# Altium project LTC2208_High-Z_probe.PrjPcb
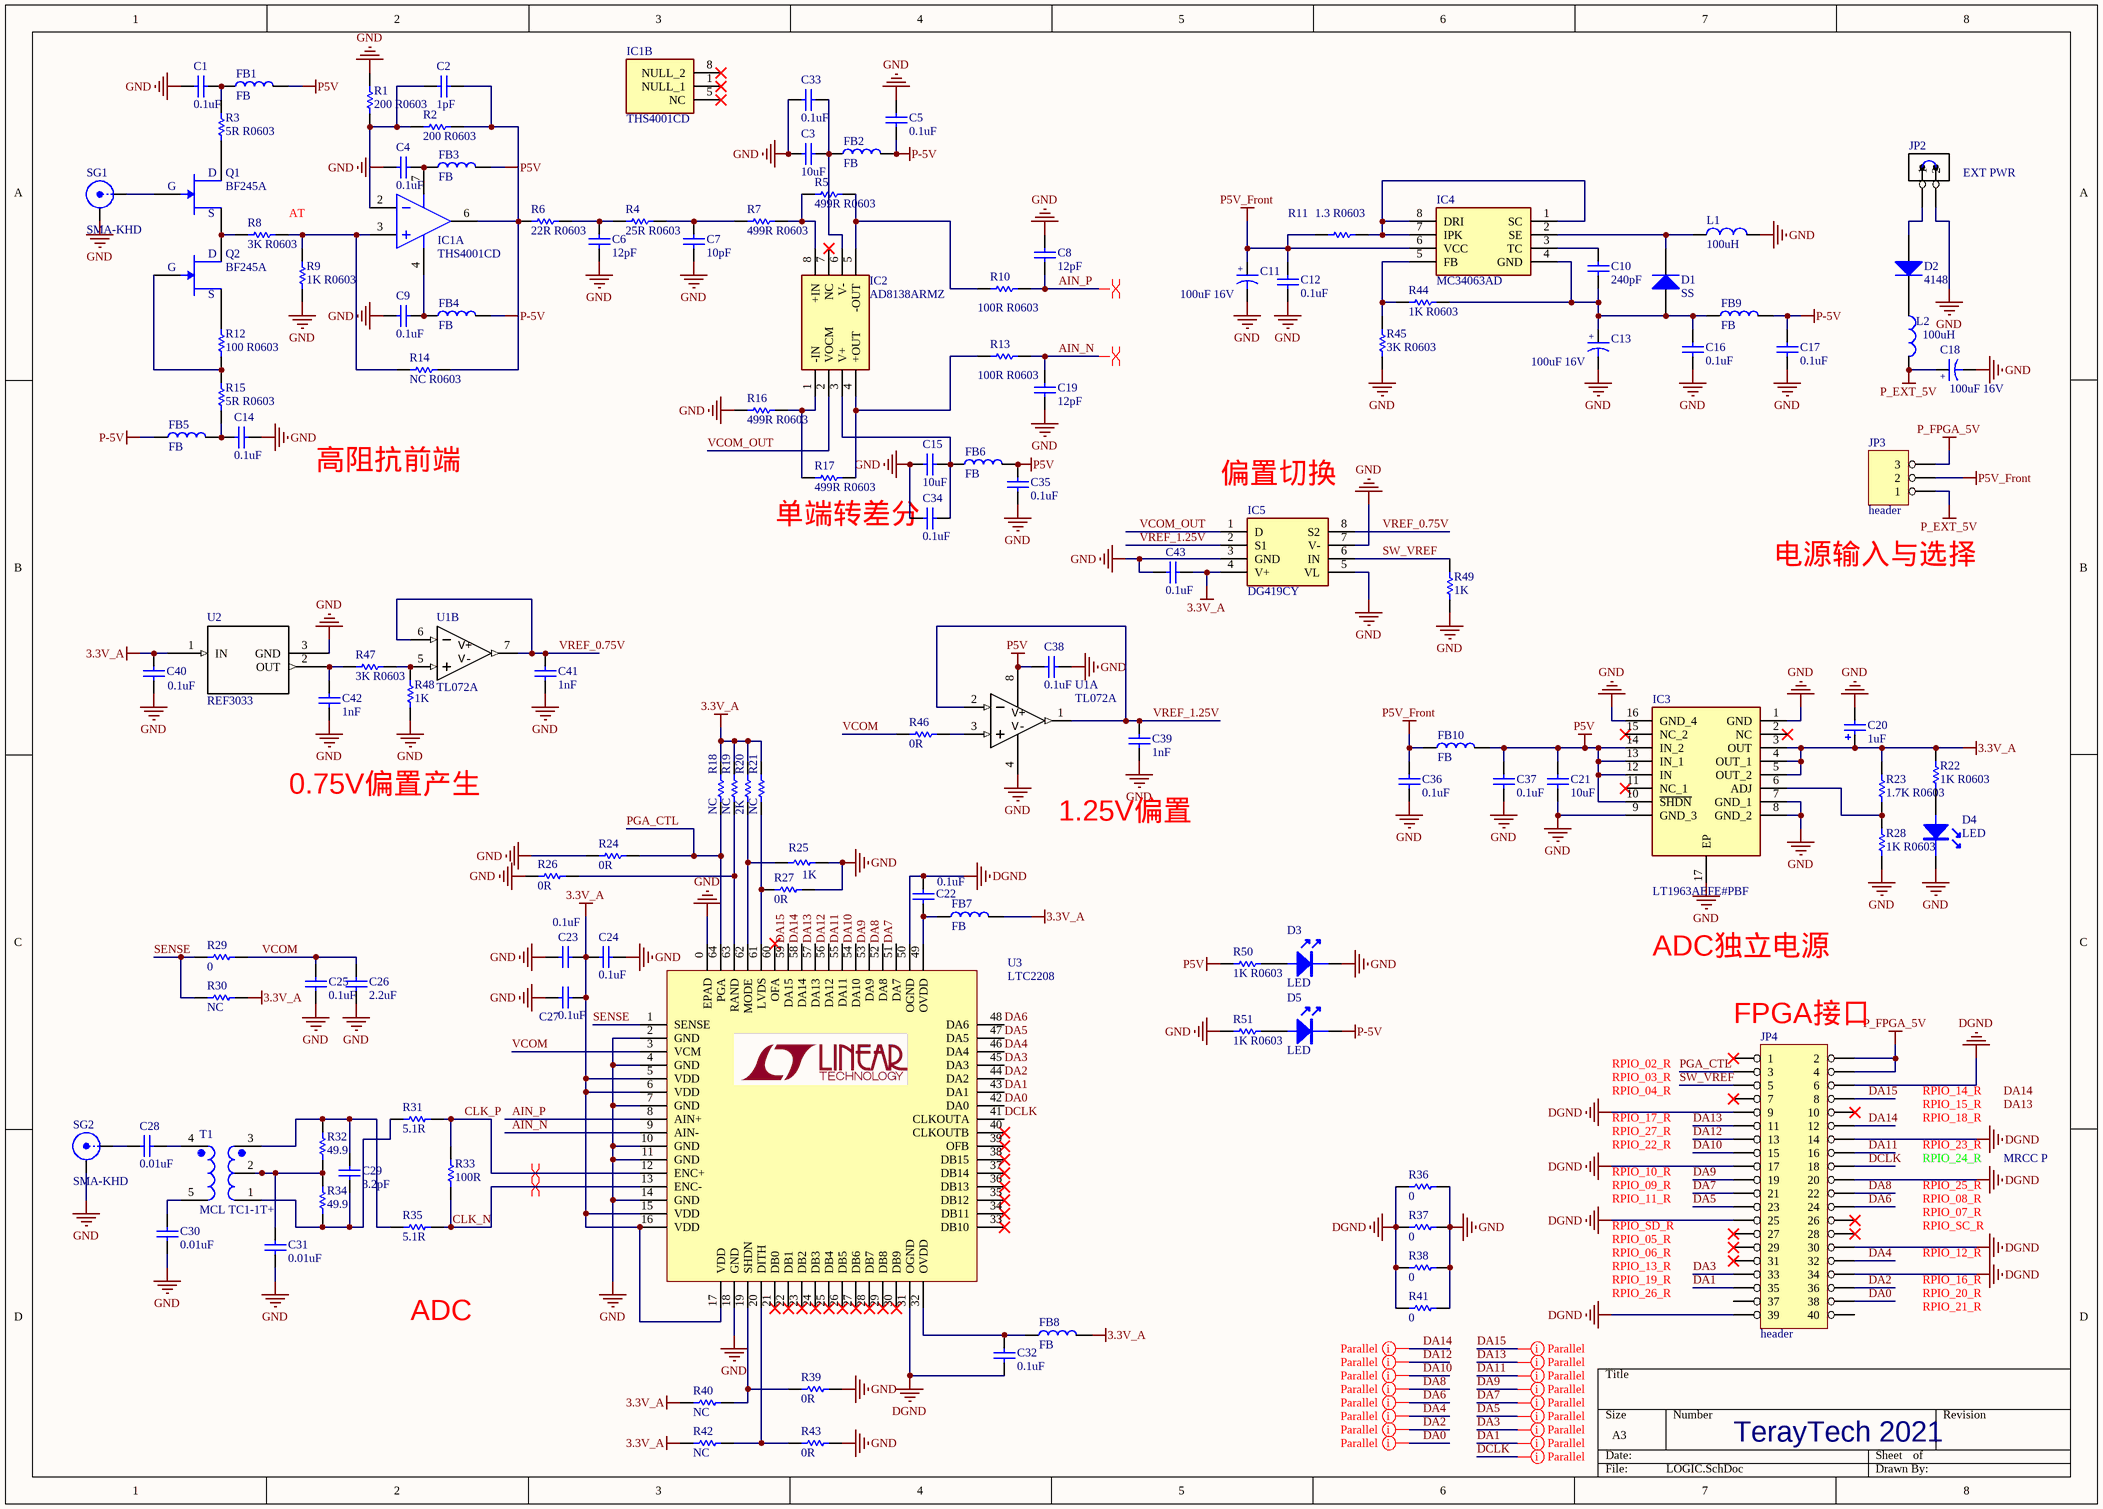
[diagram p0: LOGIC.SchDoc]
1 sheet, 127 parts. Net scope: global (net labels, ports and power ports of the same name join across sheets).
Board file: probe_v1.0.PcbDoc

## Sheet LOGIC.SchDoc
size A3

### Parts
C1  0.1uF  [0603_C]
C2  1pF  [0603_C]
C3  10uF  [0805_c]
C4  0.1uF  [0603_C]
C5  0.1uF  [0603_C]
C6  12pF  [0603_C]
C7  10pF  [0603_C]
C8  12pF  [0603_C]
C9  0.1uF  [0603_C]
C10  240pF  [0603_C]
C11  100uF 16V  [CAP_1000x2000]
C12  0.1uF  [0603_C]
C13  100uF 16V  [CAP_1000x2000]
C14  0.1uF  [0603_C]
C15  10uF  [0805_c]
C16  0.1uF  [0805_c]
C17  0.1uF  [0805_c]
C18  100uF 16V  [CAP_1000x2000]
C19  12pF  [0603_C]
C20  1uF  [CAPC3528B]
C21  10uF  [0805_c]
C22  0.1uF  [0603_C]
C23  0.1uF  [0603_C]
C24  0.1uF  [0603_C]
C25  0.1uF  [0603_C]
C26  2.2uF  [0603_C]
C27  0.1uF  [0603_C]
C28  0.01uF  [0603_C]
C29  8.2pF  [0603_C]
C30  0.01uF  [0603_C]
C31  0.01uF  [0603_C]
C32  0.1uF  [0603_C]
C33  0.1uF  [0603_C]
C34  0.1uF  [0603_C]
C35  0.1uF  [0603_C]
C36  0.1uF  [0805_c]
C37  0.1uF  [0805_c]
C38  0.1uF  [0603_C]
C39  1nF  [0603_C]
C40  0.1uF  [0603_C]
C41  1nF  [0603_C]
C42  1nF  [0603_C]
C43  0.1uF  [0603_C]
D1  SS  [DO-214AC(]
D2  4148  [DO-214AC(]
D3  LED  [0603_LED]
D4  LED  [0603_LED]
D5  LED  [0603_LED]
FB1  FB  [FB0603]
FB2  FB  [FB0603]
FB3  FB  [FB0603]
FB4  FB  [FB0603]
FB5  FB  [FB0603]
FB6  FB  [FB0603]
FB7  FB  [FB0603]
FB8  FB  [0603]
FB9  FB  [0805]
FB10  FB  [0805]
IC1  THS4001CD  [SOIC127P600X175-8N]  (parts A,B of 2)
IC2  AD8138ARMZ  [SOP65P490X110-8N]
IC3  LT1963AEFE#PBF  [SOP65P640X110-17N]
IC4  MC34063AD  [SOIC127P600X175-8N]
IC5  DG419CY  [SOIC-8]
JP2  EXT PWR  [CCM-5.08-2P]
JP3  header  [header3]
JP4  header  [header2X20]
L1  100uH  [L 5x5]
L2  100uH  [1206]
Q1  BF245A  [TO127P419X482X1041-3P]
Q2  BF245A  [TO127P419X482X1041-3P]
R1  200 R0603  [0603_R]
R2  200 R0603  [0603_R]
R3  5R R0603  [0603_R]
R4  25R R0603  [0603_R]
R5  499R R0603  [0603_R]
R6  22R R0603  [0603_R]
R7  499R R0603  [0603_R]
R8  3K R0603  [0603_R]
R9  1K R0603  [0603_R]
R10  100R R0603  [0603_R]
R11  1.3 R0603  [0603_R]
R12  100 R0603  [0603_R]
R13  100R R0603  [0603_R]
R14  NC R0603  [0603_R]
R15  5R R0603  [0603_R]
R16  499R R0603  [0603_R]
R17  499R R0603  [0603_R]
R18  NC  [0603_R]
R19  NC  [0603_R]
R20  2K  [0603_R]
R21  NC  [0603_R]
R22  1K R0603  [0603_R]
R23  1.7K R0603  [0603_R]
R24  0R  [0603_R]
R25  1K  [0603_R]
R26  0R  [0603_R]
R27  0R  [0603_R]
R28  1K R0603  [0603_R]
R29  0  [0603_R]
R30  NC  [0603_R]
R31  5.1R  [0603_R]
R32  49.9  [0603_R]
R33  100R  [0603_R]
R34  49.9  [0603_R]
R35  5.1R  [0603_R]
R36  0  [0603_R]
R37  0  [0603_R]
R38  0  [0603_R]
R39  0R  [0603_R]
R40  NC  [0603_R]
R41  0  [0603_R]
R42  NC  [0603_R]
R43  0R  [0603_R]
R44  1K R0603  [0603_R]
R45  3K R0603  [0603_R]
R46  0R  [0603_R]
R47  3K R0603  [0603_R]
R48  1K  [0603_R]
R49  1K  [0603_R]
R50  1K R0603  [0603_R]
R51  1K R0603  [0603_R]
SG1  SMA-KHD  [SMA-2]
SG2  SMA-KHD  [SMA-H - duplicate]
T1  MCL TC1-1T+  [TC1-1T]
U1  TL072A  [SOIC-8]  (parts A,B of 2)
U2  REF3033  [DBZ3]
U3  LTC2208  [QFN64]

### Nets
3.3V_A: C20.1 C23.1 C24.1 C27.1 C40.2 C43.2 FB7.2 FB8.2 IC3.3(OUT) IC3.4(OUT_1) IC3.5(OUT_2) IC5.4(V+) R18.1 R19.1 R20.1 R21.1 R22.2 R23.2 R30.1 R40.2 R42.2 U2.1(IN) U3.5(VDD) U3.6(VDD) U3.15(VDD) U3.16(VDD) U3.17(VDD)
DGND: C22.2 C32.1 JP4.6 JP4.9 JP4.14 JP4.17 JP4.20 JP4.25 JP4.30 JP4.34 JP4.39 R36.2 R37.2 R38.2 R41.2 U3.31(OGND) U3.50(OGND)
GND: C1.2 C3.2 C4.2 C5.1 C6.1 C7.1 C8.2 C9.2 C11.2 C12.1 C13.2 C14.2 C15.2 C16.1 C17.1 C18.2 C19.1 C20.2 C21.1 C23.2 C24.2 C25.1 C26.1 C27.2 C30.1 C31.1 C33.2 C34.2 C35.2 C36.1 C37.1 C38.1 C39.1 C40.1 C41.1 C42.1 C43.1 D3.2(K) D4.2(K) IC3.1(GND) IC3.7(GND_1) IC3.8(GND_2) IC3.9(GND_3) IC3.16(GND_4) IC3.17(EP) IC5.3(GND) IC5.5(VL) IC5.7(V-) JP2.2 L1.2 R1.2 R9.1 R16.1 R24.2 R25.1 R26.2 R27.1 R28.1 R36.1 R37.1 R38.1 R39.1 R41.1 R43.1 R45.1 R48.2 R49.2 R51.2 SG1.1(Y) SG2.2(X) U1.4(V-) U2.3(GND) U3.0(EPAD) U3.2(GND) U3.4(GND) U3.7(GND) U3.10(GND) U3.11(GND) U3.14(GND) U3.18(GND)
P5V: C21.2 C35.1 C37.2 C38.2 FB1.2 FB3.2 FB6.2 FB10.2 IC3.10(~{SHDN}) IC3.12(IN) IC3.13(IN_1) IC3.14(IN_2) R50.2 U1.8(V+)
P5V_Front: C11.1 C12.2 C36.2 FB10.1 IC4.6(VCC) JP3.2 R11.1
P-5V: C5.2 C17.2 D5.2(K) FB2.2 FB4.2 FB5.1 FB9.2
P_EXT_5V: C18.1 JP3.1 L2.2
P_FPGA_5V: JP3.3 JP4.2 JP4.4
AIN_N: C19.2 R13.2 U3.9(AIN-)
AIN_P: C8.1 R10.2 U3.8(AIN+)
CLK_N: R33.2 R35.2 U3.13(ENC-)
CLK_P: R31.2 R33.1 U3.12(ENC+)
DA0: JP4.38 U3.42(DA0)
DA1: JP4.35 U3.43(DA1)
DA2: JP4.36 U3.44(DA2)
DA3: JP4.33 U3.45(DA3)
DA4: JP4.32 U3.46(DA4)
DA5: JP4.23 U3.47(DA5)
DA6: JP4.24 U3.48(DA6)
DA7: JP4.21 U3.51(DA7)
DA8: JP4.22 U3.52(DA8)
DA9: JP4.19 U3.53(DA9)
DA10: JP4.15 U3.54(DA10)
DA11: JP4.16 U3.55(DA11)
DA12: JP4.13 U3.56(DA12)
DA13: JP4.11 U3.57(DA13)
DA14: JP4.12 U3.58(DA14)
DA15: JP4.8 U3.59(DA15)
DCLK: JP4.18 U3.41(CLKOUTA)
PGA_CTL: JP4.3 R18.2 R24.1 U3.64(PGA)
SENSE: R29.2 R30.2 U3.1(SENSE)
SW_VREF: IC5.6(IN) JP4.5 R49.1
VCOM: C25.2 C26.2 R29.1 R46.2 U3.3(VCM)
VCOM_OUT: IC2.2(VOCM) IC5.1(D)
VREF_0.75V: C41.2 IC5.8(S2) U1.6(2IN-) U1.7(2OUT)
VREF_1.25V: C39.2 IC5.2(S1) U1.1(1OUT) U1.2(1IN-)
NetC1_1: C1.1 FB1.1 R3.2
NetC2_1: C2.1 IC1.2(IN-) R1.1 R2.1
NetC2_2: C2.2 IC1.6(OUT) R2.2 R6.1 R14.2
NetC3_1: C3.1 C33.1 FB2.1 IC2.6(V-)
NetC4_1: C4.1 FB3.1 IC1.7(V+)
NetC6_2: C6.2 R4.1 R6.2
NetC7_2: C7.2 R4.2 R7.1
NetC9_1: C9.1 FB4.1 IC1.4(V-)
NetC10_1: C10.1 C13.1 C16.2 D1.1(A) FB9.1 IC4.4(GND) R44.2
NetC10_2: C10.2 IC4.3(TC)
NetC14_1: C14.1 FB5.2 R15.1
NetC15_1: C15.1 C34.1 FB6.1 IC2.3(V+)
NetC22_1: C22.1 FB7.1 U3.49(OVDD)
NetC28_1: C28.1 SG2.1(Y)
NetC28_2: C28.2 T1.4
NetC29_1: C29.1 R31.1 R34.2 T1.1
NetC29_2: C29.2 R32.1 R35.1 T1.3
NetC30_2: C30.2 T1.5
NetC31_2: C31.2 R32.2 R34.1 T1.2
NetC32_2: C32.2 FB8.1 U3.32(OVDD)
NetC42_2: C42.2 R47.2 U2.2(OUT)
NetD1_2: D1.2(K) IC4.2(SE) L1.1
NetD2_1: D2.1(A) JP2.1
NetD2_2: D2.2(K) L2.1
NetD3_1: D3.1(A) R50.1
NetD4_1: D4.1(A) R22.1
NetD5_1: D5.1(A) R51.1
NetIC1_3: IC1.3(IN+) R8.2 R9.2 R14.1
NetIC2_1: IC2.1(-IN) R16.2 R17.1
NetIC2_4: IC2.4(+OUT) R13.1 R17.2
NetIC2_5: IC2.5(-OUT) R5.2 R10.1
NetIC2_8: IC2.8(+IN) R5.1 R7.2
NetIC3_6: IC3.6(ADJ) R23.1 R28.2
NetIC4_1: IC4.1(SC) IC4.7(IPK) IC4.8(DRI) R11.2
NetIC4_5: IC4.5(FB) R44.1 R45.2
NetQ1_1: Q1.1(G) SG1.2(X)
NetQ1_2: Q1.2(S) Q2.3(D) R8.1
NetQ1_3: Q1.3(D) R3.1
NetQ2_1: Q2.1(G) R12.1 R15.2
NetQ2_2: Q2.2(S) R12.2
NetR19_2: R19.2 R26.1 U3.63(RAND)
NetR20_2: R20.2 R25.2 U3.62(MODE)
NetR21_2: R21.2 R27.2 U3.61(LVDS)
NetR39_2: R39.2 R40.1 U3.19(SHDN)
NetR42_1: R42.1 R43.2 U3.20(DITH)
NetR46_1: R46.1 U1.3(1IN+)
NetR47_1: R47.1 R48.1 U1.5(2IN+)

Not connected (* = marked no-connect by the designer): IC1 1(NULL_1)* 5(NC)* 8(NULL_2)*; IC2 7(NC)*; IC3 2(NC)* 11(NC_1)* 15(NC_2)*; JP4 1* 7* 10* 26* 27* 28* 29* 31* 37 40; U3 21(DB0)* 22(DB1)* 23(DB2)* 24(DB3)* 25(DB4)* 26(DB5)* 27(DB6)* 28(DB7)* 29(DB8)* 30(DB9)* 33(DB10)* 34(DB11)* 35(DB12)* 36(DB13)* 37(DB14)* 38(DB15)* 39(OFB)* 40(CLKOUTB)* 60(OFA)*

### Layout directives
net class Parallel: DA0, DA1, DA2, DA3, DA4, DA5, DA6, DA7, DA8, DA9, DA10, DA11, DA12, DA13, DA14, DA15, DCLK
differential pair: AIN_N, AIN_P, CLK_N, CLK_P

### Notes on the sheet
- (near R8) AT
- 高阻抗前端
- (near IC5) 偏置切换
- (near R17) 单端转差分
- 电源输入与选择
- 0.75V偏置产生
- 1.25V偏置
- ADC独立电源
- (near JP4) FPGA接口
- RPIO_02_R
- RPIO_03_R
- RPIO_04_R
- RPIO_17_R
- RPIO_14_R
- RPIO_15_R
- RPIO_18_R
- RPIO_27_R
- RPIO_22_R
- RPIO_10_R
- RPIO_09_R
- RPIO_23_R
- RPIO_24_R
- RPIO_25_R
- MRCC P
- RPIO_11_R
- RPIO_SD_R
- RPIO_05_R
- RPIO_06_R
- RPIO_08_R
- RPIO_07_R
- RPIO_SC_R
- RPIO_12_R
- ADC
- RPIO_13_R
- RPIO_19_R
- RPIO_26_R
- RPIO_16_R
- RPIO_20_R
- RPIO_21_R
- TerayTech 2021
- Labels drawn without touching a wire or pin: DA13, DA14
- (in symbol CAP1) +

### Library data of the parts
C1-C10 C12 C14-C17 C19 C21-C43 = CAP: Capacitor; Value: 104; Published: 8-Jun-2000; LatestRevisionDate: 17-Jul-2002; LatestRevisionNote: Re-released for DXP Platform.; PackageReference: RAD-0.3; Publisher: Altium Limited
C11 C13 C18 = CAP1
C20 = CAP_tan: Capacitor; Value: 104; Published: 8-Jun-2000; LatestRevisionDate: 17-Jul-2002; LatestRevisionNote: Re-released for DXP Platform.; PackageReference: RAD-0.3; Publisher: Altium Limited
D1 = SS24
D2 = 1N4148: High Conductance Fast Diode; Published: 8-Jun-2000; LatestRevisionDate: 17-Jul-2002; LatestRevisionNote: Re-released for DXP Platform.; DatasheetDocument: 1997; PackageReference: DO-35; Publisher: Altium Limited; Code_JEDEC: DO-204-AH; ComponentLink1Description: Manufacturer Link; ComponentLink1URL: http://www.fairchildsemi.com/; ComponentLink2Description: Datasheet; ComponentLink2URL: http://www.fairchildsemi.com/ds/1N%2F1N4448.pdf
D3-D5 = LED: LED 发光二极管
FB1-FB10 = FB: 磁珠
IC1 = THS4001CD: Integrated Circuit; Manufacturer_Name: Texas Instruments; Datasheet Link: http://www.ti.com/lit/ds/symlink/ths4001.pdf; Height: 1.75mm; Manufacturer_Part_Number: THS4001CD; Mouser Part Number: 595-THS4001CD; Mouser Price/Stock: https://www.mouser.com/Search/Refine.aspx?Keyword=595-THS4001CD; Arrow Part Number: THS4001CD; Arrow Price/Stock: https://www.arrow.com/en/products/ths4001cd/texas-instruments
IC2 = AD8138ARMZ: Integrated Circuit; Manufacturer_Name: Analog Devices; Datasheet Link: http://www.analog.com/static/imported-files/data_sheets/AD8138.pdf; Height: 1.1mm; Manufacturer_Part_Number: AD8138ARMZ; Mouser Part Number: 584-AD8138ARMZ; Mouser Price/Stock: https://www.mouser.co.uk/ProductDetail/Analog-Devices/AD8138ARMZ/?qs=%2FtpEQrCGXCyDLCXMOOw9Fw%3D%3D; Arrow Part Number: AD8138ARMZ; Arrow Price/Stock: https://www.arrow.com/en/products/ad8138armz/analog-devices
IC3 = LT1963AEFE#PBF: Integrated Circuit; Manufacturer_Name: Linear Technology; Datasheet Link: http://cds.linear.com/docs/en/datasheet/1963aff.pdf; Height: 1.1mm; Manufacturer_Part_Number: LT1963AEFE#PBF; Arrow Part Number: LT1963AEFE#PBF; Mouser Part Number: 584-LT1963AEFE#PBF; Mouser Price/Stock: https://www.mouser.com/Search/Refine.aspx?Keyword=584-LT1963AEFE%23PBF
IC4 = MC34063AD: Integrated Circuit; Manufacturer_Name: Texas Instruments; Datasheet Link: http://www.ti.com/lit/gpn/mc34063a; Height: 1.75mm; Manufacturer_Part_Number: MC34063AD; Mouser Part Number: 595-MC34063AD; Mouser Price/Stock: https://www.mouser.co.uk/ProductDetail/Texas-Instruments/MC34063AD/?qs=paYhMW8qfiu9F0uJ%2FIS%252Baw%3D%3D; Arrow Part Number: MC34063AD; Arrow Price/Stock: https://www.arrow.com/en/products/mc34063ad/texas-instruments
IC5 = DG419CY: Integrated Circuit; Manufacturer_Name: Maxim Integrated; Datasheet Link: https://datasheet.datasheetarchive.com/originals/dk/DKDS-25/482701.pdf; Height: 1.75mm; Manufacturer_Part_Number: DG419CY
JP2 = HEADER 2
JP3 = HEADER 3
JP4 = HEADER 20X2
L1 L2 = Inductor
Q1 Q2 = BF245A: Transistor; Manufacturer_Name: ON Semiconductor; Datasheet Link: https://www.onsemi.com/pub/Collateral/BF245A-D.PDF; Height: 4.19mm; Manufacturer_Part_Number: BF245A; Mouser Part Number: 863-BF245A; Mouser Price/Stock: https://www.mouser.co.uk/ProductDetail/ON-Semiconductor/BF245A?qs=R2UZ7gjkEjIWUuIS9uDwjA%3D%3D
R1-R8 R10-R17 R23 R45 R47 = RES: Resistor; Value: 1K; Published: 8-Jun-2000; Revision: July-2002: Re-released for DXP Platform.; Publisher: Altium Limited
R9 R22 R28 R44 R50 R51 = RES: Resistor; Published: 8-Jun-2000; Revision: July-2002: Re-released for DXP Platform.; Publisher: Altium Limited; Value: 1K
R18-R21 R24 R26 R27 R29-R43 R46 = RES0: Resistor; Value: 1K; Published: 8-Jun-2000; Revision: July-2002: Re-released for DXP Platform.; Publisher: Altium Limited
R25 R48 R49 = RES0: Resistor; Published: 8-Jun-2000; Revision: July-2002: Re-released for DXP Platform.; Publisher: Altium Limited; Value: 1K
SG1 SG2 = SMA_KHD
T1 = TC1-1T+
U1 = OPA2365: Imported; Manufacturer: Texas Instruments; Manufacturer_Part_Number: opa2365_d_8; INDUSTRY_STD_PKG_TYPE: SOIC; FAMILY_NAME: LOW OFFSET VOLTAGE; PIN_COUNT: 8; PACKAGE_DESIGNATOR: D; Datasheet URL: http://www.ti.com/lit/gpn/OPA2365; GENERIC_PART_NUMBER: OPA2365; Vendor: Texas Instruments; RefDes: RefDes; Type: DEV; Value: Value
U2 = REF3033_DBZ_3: Imported; Manufacturer: Texas Instruments; INDUSTRY_STD_PKG_TYPE: SOT-23; FAMILY_NAME: SERIES VOLTAGE REFERENCE; PIN_COUNT: 3; PACKAGE_DESIGNATOR: DBZ; Datasheet URL: http://www.ti.com/lit/gpn/REF3033; GENERIC_PART_NUMBER: REF3033; Vendor: Texas Instruments; Manufacturer_Part_Number: ref3033_dbz_3; RefDes: RefDes; Type: DEV; Value: Value